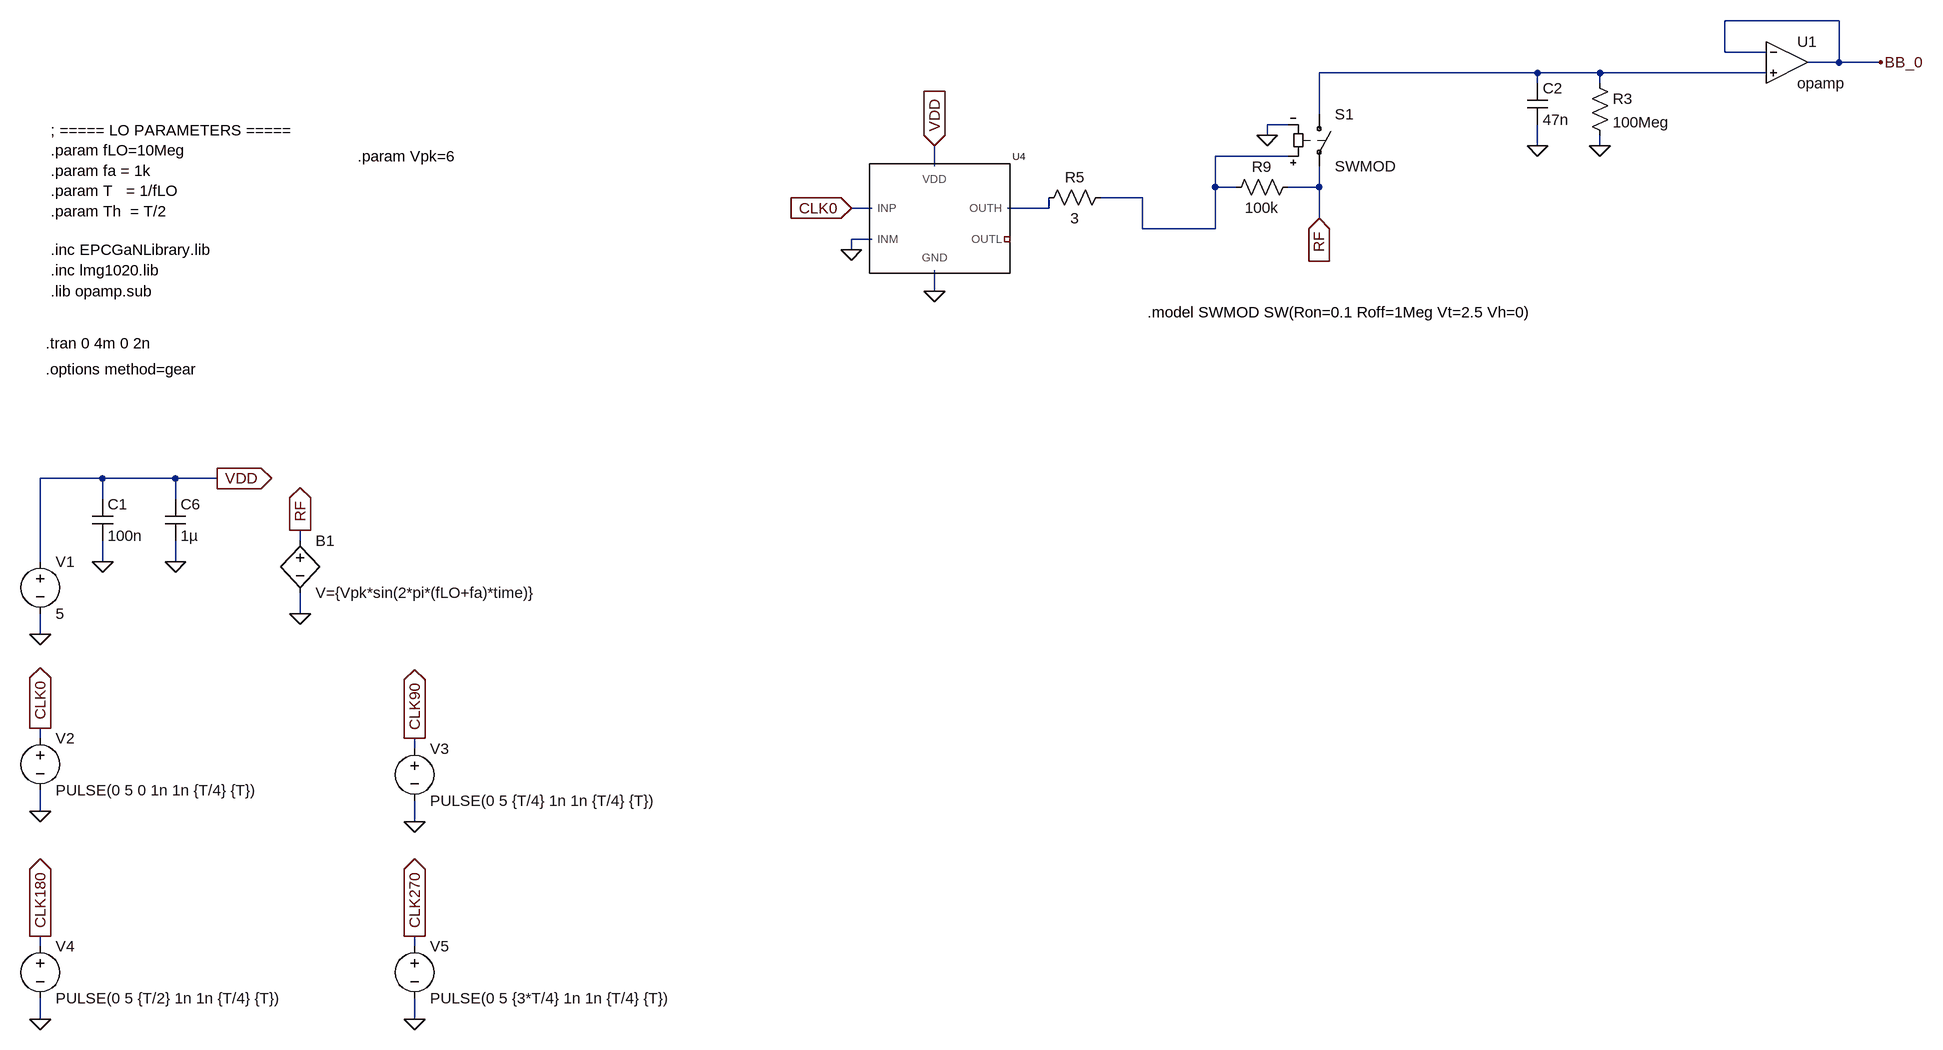
[diagram p0: schematic epc2037_4_channel.asc]
epc2037_4_channel.asc, the LTspice schematic file:
Version 4.1
SHEET 1 2160 2448
WIRE 1968 -736 1792 -736
WIRE 1792 -688 1792 -736
WIRE 1856 -688 1792 -688
WIRE 1968 -672 1968 -736
WIRE 1968 -672 1920 -672
WIRE 2032 -672 1968 -672
WIRE 1504 -656 1168 -656
WIRE 1600 -656 1504 -656
WIRE 1856 -656 1600 -656
WIRE 1504 -640 1504 -656
WIRE 1600 -640 1600 -656
WIRE 1168 -592 1168 -656
WIRE 1120 -576 1088 -576
WIRE 1088 -560 1088 -576
WIRE 1504 -544 1504 -576
WIRE 1600 -544 1600 -560
WIRE 1120 -528 1008 -528
WIRE 576 -512 576 -544
WIRE 1008 -480 1008 -528
WIRE 1040 -480 1008 -480
WIRE 1168 -480 1168 -512
WIRE 1168 -480 1120 -480
WIRE 896 -464 832 -464
WIRE 480 -448 448 -448
WIRE 752 -448 752 -464
WIRE 752 -448 688 -448
WIRE 1168 -432 1168 -480
WIRE 896 -416 896 -464
WIRE 1008 -416 1008 -480
WIRE 1008 -416 896 -416
WIRE 480 -400 448 -400
WIRE 448 -384 448 -400
WIRE 576 -320 576 -352
WIRE -704 -32 -800 -32
WIRE -592 -32 -704 -32
WIRE -528 -32 -592 -32
WIRE -704 0 -704 -32
WIRE -592 0 -592 -32
WIRE -400 64 -400 48
WIRE -800 96 -800 -32
WIRE -704 96 -704 64
WIRE -592 96 -592 64
WIRE -400 176 -400 144
WIRE -800 208 -800 176
WIRE -800 368 -800 352
WIRE -224 384 -224 368
WIRE -800 480 -800 448
WIRE -224 496 -224 464
WIRE -800 688 -800 672
WIRE -224 688 -224 672
WIRE -800 800 -800 768
WIRE -224 800 -224 768
FLAG -800 208 0
FLAG -224 496 0
FLAG -400 176 0
FLAG -528 -32 VDD
IOPIN -528 -32 Out
FLAG -400 48 RF
IOPIN -400 48 Out
FLAG -800 672 CLK180
IOPIN -800 672 Out
FLAG -704 96 0
FLAG -800 800 0
FLAG -224 368 CLK90
IOPIN -224 368 Out
FLAG 1504 -544 0
FLAG 1600 -544 0
FLAG 2032 -672 BB_0
FLAG -800 352 CLK0
IOPIN -800 352 Out
FLAG -800 480 0
FLAG -224 672 CLK270
IOPIN -224 672 Out
FLAG -224 800 0
FLAG 1168 -432 RF
IOPIN 1168 -432 In
FLAG -592 96 0
FLAG 576 -544 VDD
IOPIN 576 -544 In
FLAG 448 -448 CLK0
IOPIN 448 -448 In
FLAG 448 -384 0
FLAG 576 -320 0
FLAG 1088 -560 0
SYMBOL voltage -800 80 R0
WINDOW 123 0 0 Left 0
WINDOW 39 0 0 Left 0
SYMATTR InstName V1
SYMATTR Value 5
SYMBOL voltage -224 368 R0
WINDOW 123 0 0 Left 0
WINDOW 39 0 0 Left 0
SYMATTR InstName V3
SYMATTR Value PULSE(0 5 {T/4} 1n 1n {T/4} {T})
SYMBOL cap -720 0 R0
SYMATTR InstName C1
SYMATTR Value 100n
SYMBOL voltage -800 672 R0
WINDOW 123 0 0 Left 0
WINDOW 39 0 0 Left 0
SYMATTR InstName V4
SYMATTR Value PULSE(0 5 {T/2} 1n 1n {T/4} {T})
SYMBOL OpAmps\\opamp 1888 -736 R0
SYMATTR InstName U1
SYMBOL cap 1488 -640 R0
SYMATTR InstName C2
SYMATTR Value 47n
SYMBOL res 1584 -656 R0
SYMATTR InstName R3
SYMATTR Value 100Meg
SYMBOL bv -400 48 R0
SYMATTR InstName B1
SYMATTR Value V={Vpk*sin(2*pi*(fLO+fa)*time)}
SYMBOL voltage -800 352 R0
WINDOW 123 0 0 Left 0
WINDOW 39 0 0 Left 0
SYMATTR InstName V2
SYMATTR Value PULSE(0 5 0 1n 1n {T/4} {T})
SYMBOL voltage -224 672 R0
WINDOW 123 0 0 Left 0
WINDOW 39 0 0 Left 0
SYMATTR InstName V5
SYMATTR Value PULSE(0 5 {3*T/4} 1n 1n {T/4} {T})
SYMBOL lmg1020 576 -448 R0
SYMATTR InstName U4
SYMBOL cap -608 0 R0
SYMATTR InstName C6
SYMATTR Value 1µ
SYMBOL res 848 -480 R90
WINDOW 0 0 56 VBottom 2
WINDOW 3 32 56 VTop 2
SYMATTR InstName R5
SYMATTR Value 3
SYMBOL res 1136 -496 R90
WINDOW 0 0 56 VBottom 2
WINDOW 3 32 56 VTop 2
SYMATTR InstName R9
SYMATTR Value 100k
SYMBOL sw 1168 -608 R0
SYMATTR InstName S1
SYMATTR Value SWMOD
TEXT -792 -240 Left 2 !.tran 0 4m 0 2n
TEXT -792 -200 Left 2 !.options method=gear
TEXT -784 -320 Left 2 !.lib opamp.sub
TEXT -784 -568 Left 2 !; ===== LO PARAMETERS =====\n.param fLO=10Meg\n.param fa = 1k\n.param T   = 1/fLO\n.param Th  = T/2
TEXT -312 -528 Left 2 !.param Vpk=6
TEXT -784 -352 Left 2 !.inc lmg1020.lib
TEXT -784 -384 Left 2 !.inc EPCGaNLibrary.lib
TEXT 904 -288 Left 2 !.model SWMOD SW(Ron=0.1 Roff=1Meg Vt=2.5 Vh=0)

The netlist it stands for:
* epc2037_4_channel.asc
V1 VDD 0 5
V3 CLK90 0 PULSE(0 5 {T/4} 1n 1n {T/4} {T})
C1 VDD 0 100n
V4 CLK180 0 PULSE(0 5 {T/2} 1n 1n {T/4} {T})
X§U1 BB_0 N001 BB_0 opamp Aol=100K GBW=10Meg  ; pins invin noninvin out
C2 N001 0 47n
R3 N001 0 100Meg
B1 RF 0 V={Vpk*sin(2*pi*(fLO+fa)*time)}
V2 CLK0 0 PULSE(0 5 0 1n 1n {T/4} {T})
V5 CLK270 0 PULSE(0 5 {3*T/4} 1n 1n {T/4} {T})
X§U4 VDD 0 CLK0 N003 NC_01 0 LMG1020  ; pins VDD GND INP OUTH OUTL INM
C6 VDD 0 1µ
R5 N002 N003 3
R9 RF N002 100k
S1 N001 RF N002 0 SWMOD
.tran 0 4m 0 2n
.options method=gear
.lib opamp.sub
; ===== LO PARAMETERS =====
.param fLO=10Meg
.param fa = 1k
.param T   = 1/fLO
.param Th  = T/2
.param Vpk=6
.inc lmg1020.lib
.inc EPCGaNLibrary.lib
.model SWMOD SW(Ron=0.1 Roff=1Meg Vt=2.5 Vh=0)
.backanno
.end